# EAGLE schematic arduino_due_v.1 (EAGLE 8.2.0)
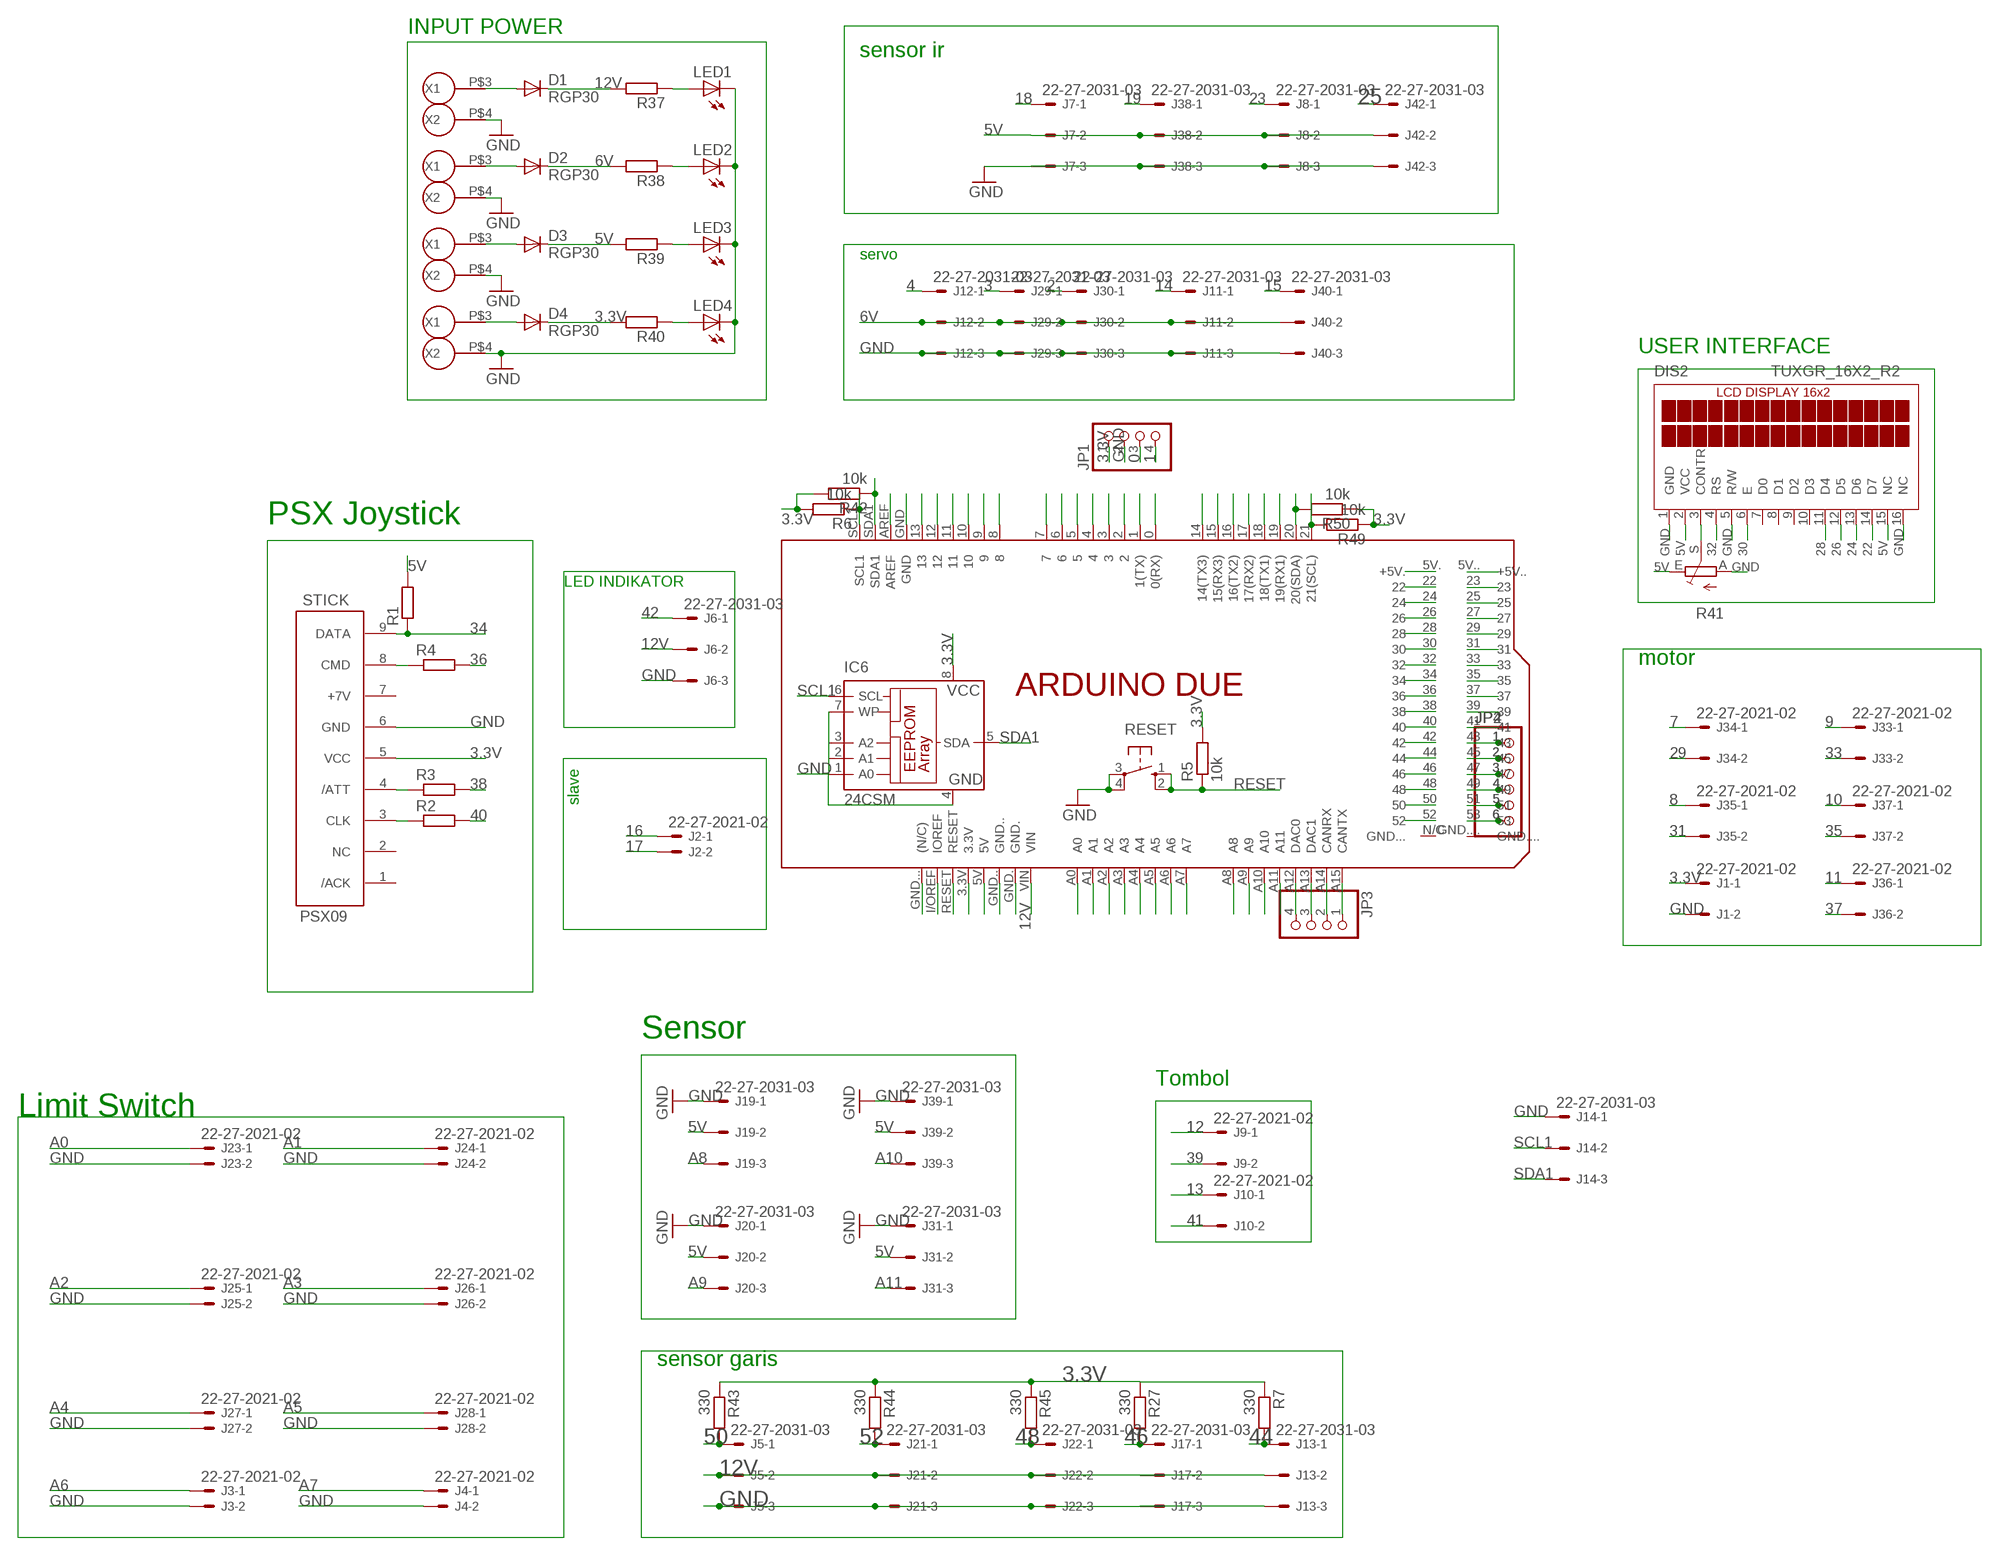
[diagram p0: schematic, sheet 1]

## Parts
D1  RGP30  [DO201-15]
D2  RGP30  [DO201-15]
D3  RGP30  [DO201-15]
D4  RGP30  [DO201-15]
DIS2  TUXGR_16X2_R2  [TUXGR_16X2_R2]
IC6  24CSM  24C02CSM  [SO-08M]
J1  22-27-2021-02  [6410-02]
J2  22-27-2021-02  [6410-02]
J3  22-27-2021-02  [6410-02]
J4  22-27-2021-02  [6410-02]
J5  22-27-2031-03  [6410-03]
J6  22-27-2031-03  [6410-03]
J7  22-27-2031-03  [6410-03]
J8  22-27-2031-03  [6410-03]
J9  22-27-2021-02  [6410-02]
J10  22-27-2021-02  [6410-02]
J11  22-27-2031-03  [6410-03]
J12  22-27-2031-03  [6410-03]
J13  22-27-2031-03  [6410-03]
J14  22-27-2031-03  [6410-03]
J17  22-27-2031-03  [6410-03]
J19  22-27-2031-03  [6410-03]
J20  22-27-2031-03  [6410-03]
J21  22-27-2031-03  [6410-03]
J22  22-27-2031-03  [6410-03]
J23  22-27-2021-02  [6410-02]
J24  22-27-2021-02  [6410-02]
J25  22-27-2021-02  [6410-02]
J26  22-27-2021-02  [6410-02]
J27  22-27-2021-02  [6410-02]
J28  22-27-2021-02  [6410-02]
J29  22-27-2031-03  [6410-03]
J30  22-27-2031-03  [6410-03]
J31  22-27-2031-03  [6410-03]
J33  22-27-2021-02  [6410-02]
J34  22-27-2021-02  [6410-02]
J35  22-27-2021-02  [6410-02]
J36  22-27-2021-02  [6410-02]
J37  22-27-2021-02  [6410-02]
J38  22-27-2031-03  [6410-03]
J39  22-27-2031-03  [6410-03]
J40  22-27-2031-03  [6410-03]
J42  22-27-2031-03  [6410-03]
JP1  PINHD-1X4  [1X04]
JP2  PINHD-1X6  [1X06]
JP3  PINHD-1X4  [1X04]
JP4  PINHD-1X6  [1X06]
LED1  LED3MM  [LED3MM]
LED2  LED3MM  [LED3MM]
LED3  LED3MM  [LED3MM]
LED4  LED3MM  [LED3MM]
PCB1  ARDUINO_DUE  [ARDUINO_DUE]
R1  R-EU_M0805  [M0805]
R2  R-EU_M0805  [M0805]
R3  R-EU_M0805  [M0805]
R4  R-EU_M0805  [M0805]
R5  10k  R-EU_M0805  [M0805]
R6  10k  R-EU_M0805  [M0805]
R7  330  R-EU_M0805  [M0805]
R27  330  R-EU_M0805  [M0805]
R37  R-EU_M0805  [M0805]
R38  R-EU_M0805  [M0805]
R39  R-EU_M0805  [M0805]
R40  R-EU_M0805  [M0805]
R41  TRIM_EU-CA6V  [CA6V]
R42  10k  R-EU_M0805  [M0805]
R43  330  R-EU_M0805  [M0805]
R44  330  R-EU_M0805  [M0805]
R45  330  R-EU_M0805  [M0805]
R49  10k  R-EU_M0805  [M0805]
R50  10k  R-EU_M0805  [M0805]
RESET  40-XX  [B3F-40XX]
STICK  PSX09  [PSX09]
U$1  TB9.5  [TB9.5]
U$2  TB9.5  [TB9.5]
U$3  TB9.5  [TB9.5]
U$8  TB9.5  [TB9.5]

## Nets
0: JP1.3 PCB1.0(0(RX))
1: JP1.4 PCB1.1(1(TX))
2: J30.1 PCB1.2
3: J29.1 PCB1.3
3.3V: D4.C IC6.8(VCC) J1.1 JP1.1 R5.2 R6.2 R7.1 R27.1 R40.2 R42.2 R43.1 R44.1 R45.1 R49.1 R50.1 STICK.5(VCC)
4: J12.1 PCB1.4
5: PCB1.5
5V: D3.C DIS2.2(VCC) DIS2.15(NC) J7.2 J8.2 J19.2 J20.2 J31.2 J38.2 J39.2 J42.2 R1.2 R39.2 R41.E
6: PCB1.6
6V: D2.C J11.2 J12.2 J29.2 J30.2 J40.2 R38.2
7: J34.1 PCB1.7
8: J35.1 PCB1.8
9: J33.1 PCB1.9
10: J37.1 PCB1.10
11: J36.1 PCB1.11
12: J9.1 PCB1.12
12V: D1.C J5.2 J6.2 J13.2 J17.2 J21.2 J22.2 PCB1.VIN R37.2
13: J10.1 PCB1.13
14: J11.1 PCB1.14(14(TX3))
15: J40.1 PCB1.15(15(RX3))
16: J2.1 PCB1.16(16(TX2))
17: J2.2 PCB1.17(17(RX2))
18: J7.1 PCB1.18(18(TX1))
19: J38.1 PCB1.19(19(RX1))
22: DIS2.14(D7) PCB1.22
23: J8.1 PCB1.23
24: DIS2.13(D6) PCB1.24
25: J42.1 PCB1.25
26: DIS2.12(D5) PCB1.26
27: PCB1.27
28: DIS2.11(D4) PCB1.28
29: J34.2 PCB1.29
30: DIS2.6(E) PCB1.30
31: J35.2 PCB1.31
32: DIS2.4(RS) PCB1.32
33: J33.2 PCB1.33
34: PCB1.34 R1.1 STICK.9(DATA)
35: J37.2 PCB1.35
36: PCB1.36 R4.2
37: J36.2 PCB1.37
38: PCB1.38 R3.2
39: J9.2 PCB1.39
40: PCB1.40 R2.2
41: J10.2 PCB1.41
42: J6.1 PCB1.42
43: JP2.1 JP4.1 PCB1.43
44: J13.1 PCB1.44 R7.2
45: JP2.2 JP4.2 PCB1.45
46: J17.1 PCB1.46 R27.2
47: JP2.3 JP4.3 PCB1.47
48: J22.1 PCB1.48 R45.2
49: JP2.4 JP4.4 PCB1.49
50: J5.1 PCB1.50 R43.2
51: JP2.5 JP4.5 PCB1.51
52: J21.1 PCB1.52 R44.2
53: JP2.6 JP4.6 PCB1.53
A0: J23.1 PCB1.A0
A1: J24.1 PCB1.A1
A2: J25.1 PCB1.A2
A3: J26.1 PCB1.A3
A4: J27.1 PCB1.A4
A5: J28.1 PCB1.A5
A6: J3.1 PCB1.A6
A7: J4.1 PCB1.A7
A8: J19.3 PCB1.A8
A9: J20.3 PCB1.A9
A10: J39.3 PCB1.A10
A11: J31.3 PCB1.A11
AREF: PCB1.AREF
GND: DIS2.1(GND) DIS2.5(R/W) DIS2.16(NC) IC6.1(A0) IC6.2(A1) IC6.3(A2) IC6.4(GND) IC6.7(WP) J1.2 J3.2 J4.2 J5.3 J6.3 J7.3 J8.3 J11.3 J12.3 J13.3 J14.1 J17.3 J19.1 J20.1 J21.3 J22.3 J23.2 J24.2 J25.2 J26.2 J27.2 J28.2 J29.3 J30.3 J31.1 J38.3 J39.1 J40.3 J42.3 JP1.2 LED1.K(C) LED2.K(C) LED3.K(C) LED4.K(C) PCB1.GND R41.A RESET.3(P) RESET.4(P1) STICK.6(GND) U$1.P$4(X2) U$2.P$4(X2) U$3.P$4(X2) U$8.P$4(X2)
N$1: R3.1 STICK.4(/ATT)
N$2: R2.1 STICK.3(CLK)
N$3: R4.1 STICK.8(CMD)
N$6: DIS2.3(CONTR) R41.S
N$8: LED1.A R37.1
N$9: LED2.A R38.1
N$13: D1.A U$8.P$3(X1)
N$14: D2.A U$1.P$3(X1)
N$21: D3.A U$2.P$3(X1)
N$22: D4.A U$3.P$3(X1)
N$23: JP3.1 PCB1.A15(CANTX)
N$24: JP3.2 PCB1.A14(CANRX)
N$25: LED3.A R39.1
N$30: PCB1.5V.(+5V.)
N$42: LED4.A R40.1
N$51: JP3.3 PCB1.A13(DAC1)
N$52: JP3.4 PCB1.A12(DAC0)
N$65: PCB1.5V..(+5V..)
N$66: PCB1.GND...((N/C))
N$67: PCB1.I/OREF(IOREF)
N$69: PCB1.3.3V
N$70: PCB1.5V
N$71: PCB1.GND..
N$72: PCB1.GND.
RESET: PCB1.RESET R5.1 RESET.1(S) RESET.2(S1)
SCL: PCB1.21(21(SCL)) R49.2
SCL1: IC6.6(SCL) J14.2 PCB1.SCL1 R6.1
SDA: PCB1.20(20(SDA)) R50.2
SDA1: IC6.5(SDA) J14.3 PCB1.SDA1 R42.1
Unconnected: DIS2.7(D0) DIS2.8(D1) DIS2.9(D2) DIS2.10(D3) PCB1.GND.... PCB1.N/C(GND...) STICK.1(/ACK) STICK.2(NC) STICK.7(+7V)

## Notes on the sheet
- INPUT POWER | sensor ir
- servo
- USER INTERFACE
- PSX Joystick
- LED INDIKATOR
- motor
- slave
- Sensor
- Tombol
- Limit Switch
- sensor garis

## Library data of the parts
D1-D4 = diode:RGP30: DIODE fast-recovery rectifier
DIS2 = display-lcd:TUXGR_16X2_R2: Tuxgraphics LCD display 16x2 characters reflective, without background light Source: tuxgr_12x2_r2.pdf; OC_FARNELL: unknown; OC_NEWARK: unknown
IC6 = microchip:24C*: Serial EEPROM 1 K/2 K/4 K; MPN: AT24C04BN-SH-B; OC_FARNELL: 1362643; OC_NEWARK: 50M3316
J1-J4 J9 J10 J23-J28 J33-J37 = con-molex:22-?-02: CONNECTOR wire to board 2.54 mm (.1 inch) pitch header; OC_FARNELL: unknown; OC_NEWARK: unknown
J5-J8 J11-J14 J17 J19-J22 J29-J31 J38-J40 J42 = con-molex:22-?-03: CONNECTOR wire to board 2.54 mm (.1 inch) pitch header; OC_FARNELL: unknown; OC_NEWARK: unknown
JP1 JP3 = pinhead:PINHD-1X4: PIN HEADER
JP2 JP4 = pinhead:PINHD-1X6: PIN HEADER
LED1-LED4 = led:LED: LED OSRAM: - CHIPLED LG R971, LG N971, LY N971, LG Q971, LY Q971, LO R971, LY R971 LH N974, LH R974 LS Q976, LO Q976, LY Q976 LO Q996 - Hyper CHIPLED LW Q18S LB Q993, LB Q99A, LB R99A - SideLED LS A670, LO A670, LY A670, LG A670, LP A670 LB A673, LV A673, LT A673, LW A673 LH A674 LY A675 LS A676, LA A676, LO A676, LY A676, LW A676 LS A679, LY A679, LG A679 - Hyper Micro SIDELED® LS Y876, LA Y876, LO Y876, LY Y876 LT Y87S - SmartLED LW L88C, LW L88S LB L89C, LB L89S, LG L890 LS L89K, LO L89K, LY L89K LS L896, LA L896, LO L896, LY L896 - TOPLED LS T670, LO T670, LY T670, LG T670, LP T670 LSG T670, LSP T670, LSY T670, LOP T670, LYG T670 LG T671, LOG T671, LSG T671 LB T673, LV T673, LT T673, LW T673 LH T674 LS T676, LA T676, LO T676, LY T676, LB T676, LH T676, LSB T676, LW T676 LB T67C, LV T67C, LT T67C, LS T67K, LO T67K, LY T67K, LW E67C LS E67B, LA E67B, LO E67B, LY E67B, LB E67C, LV E67C, LT E67C LW T67C LS T679, LY T679, LG T679 LS T770, LO T770, LY T770, LG T770, LP T770 LB T773, LV T773, LT T773, LW T773 LH T774 LS E675, LA E675, LY E675, LS T675 LS T776, LA T776, LO T776, LY T776, LB T776 LHGB T686 LT T68C, LB T68C - Hyper Mini TOPLED® LB M676 - Mini TOPLED Santana® LG M470 LS M47K, LO M47K, LY M47K Source: http://www.osram.convergy.de LUXEON: - LUMILED® LXK2-PW12-R00, LXK2-PW12-S00, LXK2-PW14-U00, LXK2-PW14-V00 LXK2-PM12-R00, LXK2-PM12-S00, LXK2-PM14-U00 LXK2-PE12-Q00, LXK2-PE12-R00, LXK2-PE12-S00, LXK2-PE14-T00, LXK2-PE14-U00 LXK2-PB12-K00, LXK2-PB12-L00, LXK2-PB12-M00, LXK2-PB14-N00, LXK2-PB14-P00, LXK2-PB14-Q00 LXK2-PR12-L00, LXK2-PR12-M00, LXK2-PR14-Q00, LXK2-PR14-R00 LXK2-PD12-Q00, LXK2-PD12-R00, LXK2-PD12-S00 LXK2-PH12-R00, LXK2-PH12-S00 LXK2-PL12-P00, LXK2-PL12-Q00, LXK2-PL12-R00 Source: www.luxeon.com KINGBRIGHT: KA-3528ASYC Source: www.kingbright.com
PCB1 = E14_Arduino_revC:ARDUINO_DUE: Device for representing an Arduino Due board with a footprint in an EAGLE design. Created by Dave Young for Element14. More EAGLE documentation at: http://www.element14.com/community/community/knode/cadsoft_eagle
R1-R7 R27 R37-R40 R42-R45 R49 R50 = rcl:R-EU_: RESISTOR, European symbol
R41 = pot:TRIM_EU-: POTENTIOMETER
RESET = switch-omron:40-XX: OMRON SWITCH; MF: OMRON COMPONENTS USA; MPN: B3F-4000; OC_FARNELL: 176434; OC_NEWARK: 36K3105
STICK = DexterIndustries 3.0:PSX09: Adapter for Playstation 2 Controller Port.; PSW: w
U$1-U$3 U$8 = TB9.5:TB9.5

## Net classes
2 gnd: width 0.305 mm, drill 0.711 mm, clearance 0.203 mm